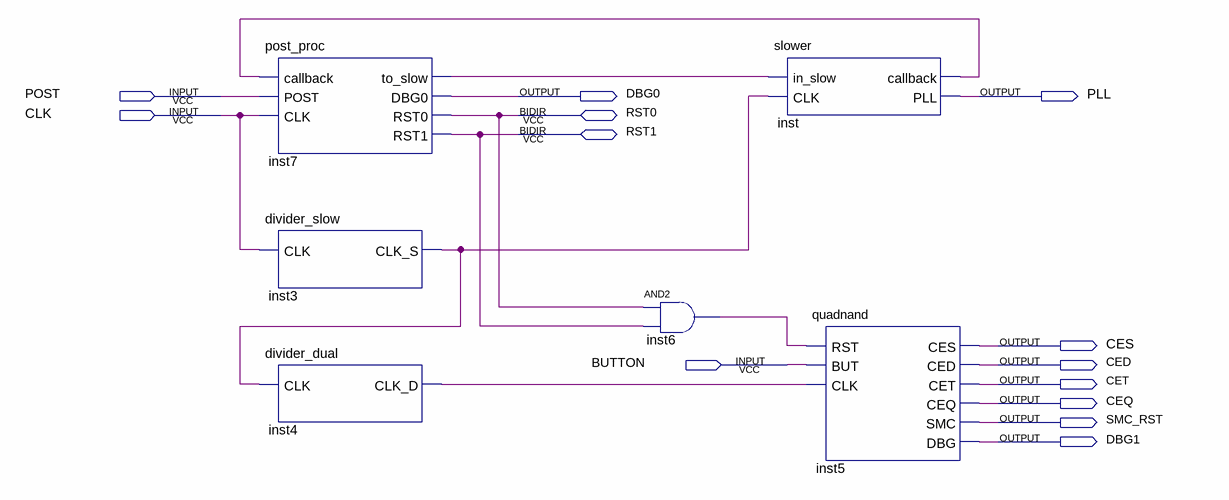
[diagram p0: schematic sheet]
// Quartus schematic main.bdf as structural Verilog: 6 symbols, 13 pins
module main (
  input  POST,
  input  CLK,
  input  BUTTON,
  inout  RST0,
  inout  RST1,
  output DBG0,
  output PLL,
  output CES,
  output CED,
  output CET,
  output CEQ,
  output SMC_RST,
  output DBG1
);

  wire inst3_clk_s, inst4_clk_d, inst6_out, inst7_to_slow, inst_callback;

  post_proc inst7 (
    .callback(inst_callback), .POST(POST), .CLK(CLK), .to_slow(inst7_to_slow), .DBG0(DBG0), .RST0(RST0),
    .RST1(RST1));
  divider_slow inst3 (.CLK(CLK), .CLK_S(inst3_clk_s));
  divider_dual inst4 (.CLK(inst3_clk_s), .CLK_D(inst4_clk_d));
  and inst6 (inst6_out, RST0, RST1);
  slower inst (.in_slow(inst7_to_slow), .CLK(inst3_clk_s), .callback(inst_callback), .PLL(PLL));
  quadnand inst5 (
    .RST(inst6_out), .BUT(BUTTON), .CLK(inst4_clk_d), .CES(CES), .CED(CED), .CET(CET), .CEQ(CEQ),
    .SMC(SMC_RST), .DBG(DBG1));
endmodule
